# Altium schematic sheet Pinout_Toygether_Sch.SchDoc
size A4
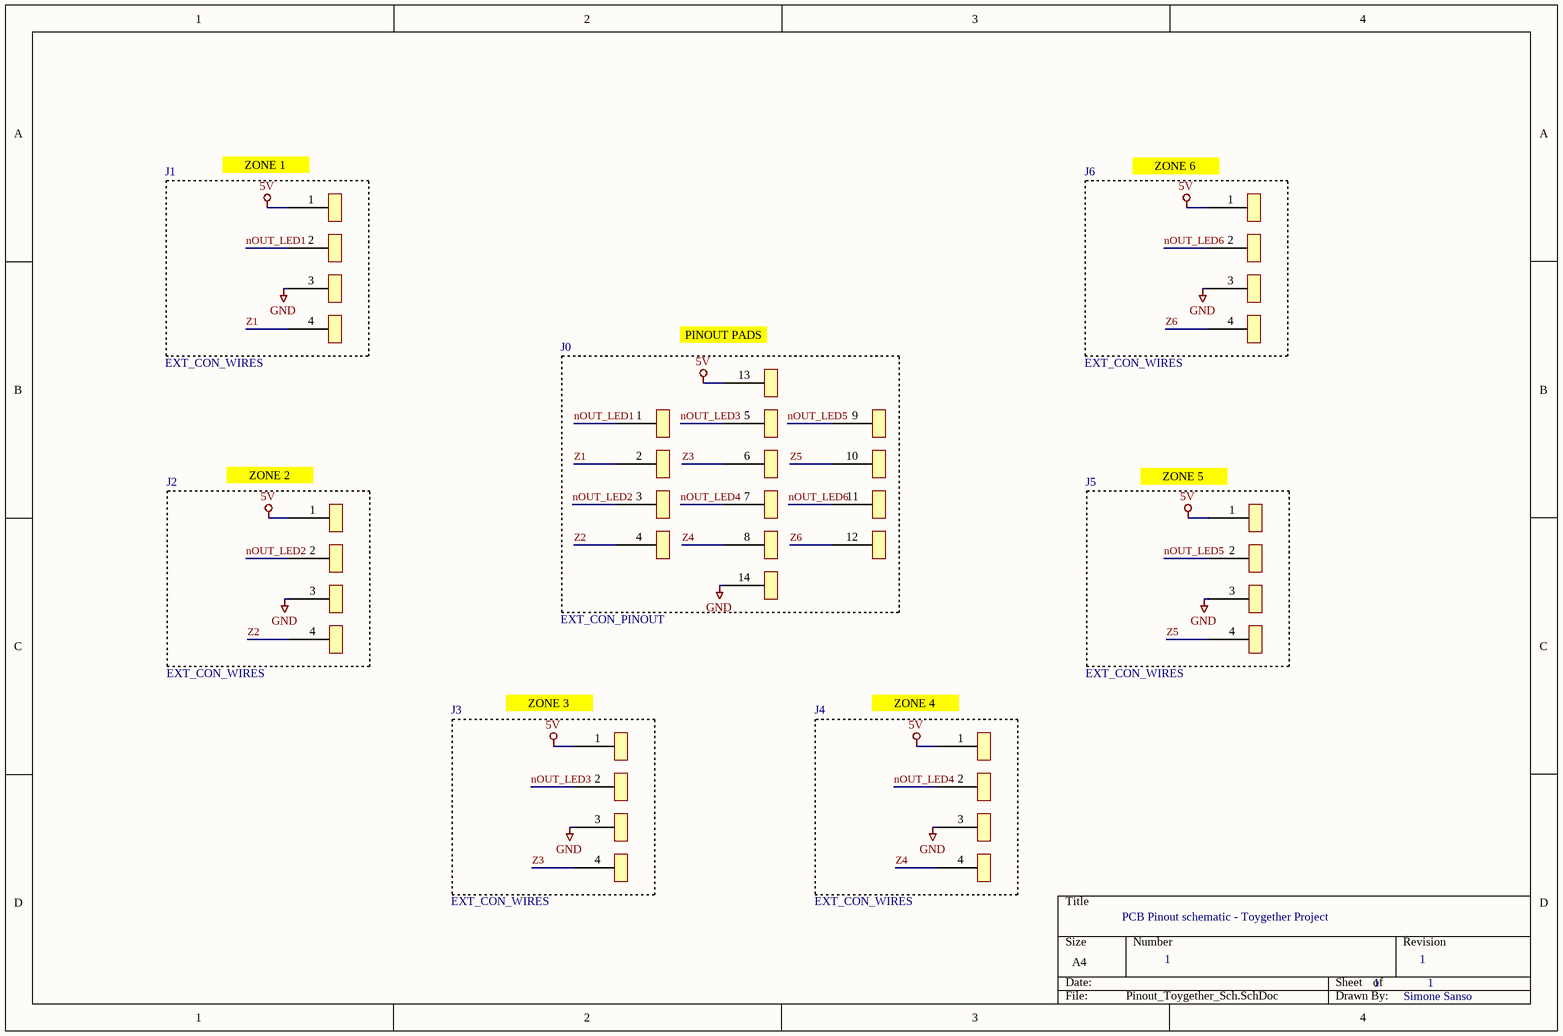
[diagram p0: Pinout_Toygether_Sch.SchDoc]

## Parts
J0  EXT_CON_PINOUT  [EXT_CON_PINOUT_14P]
J1  EXT_CON_WIRES  [EXT_CON_WIRES_4P]
J2  EXT_CON_WIRES  [EXT_CON_WIRES_4P]
J3  EXT_CON_WIRES  [EXT_CON_WIRES_4P]
J4  EXT_CON_WIRES  [EXT_CON_WIRES_4P]
J5  EXT_CON_WIRES  [EXT_CON_WIRES_4P]
J6  EXT_CON_WIRES  [EXT_CON_WIRES_4P]

## Nets
5V: J0.13 J1.1 J2.1 J3.1 J4.1 J5.1 J6.1
GND: J0.14 J1.3 J2.3 J3.3 J4.3 J5.3 J6.3
nOUT_LED1: J0.1 J1.2
nOUT_LED2: J0.3 J2.2
nOUT_LED3: J0.5 J3.2
nOUT_LED4: J0.7 J4.2
nOUT_LED5: J0.9 J5.2
nOUT_LED6: J0.11 J6.2
Z1: J0.2 J1.4
Z2: J0.4 J2.4
Z3: J0.6 J3.4
Z4: J0.8 J4.4
Z5: J0.10 J5.4
Z6: J0.12 J6.4

## Notes on the sheet
- (near J1) ZONE 1
- (near J6) ZONE 6
- (near J0) PINOUT PADS
- (near J2) ZONE 2
- (near J5) ZONE 5
- (near J3) ZONE 3
- (near J4) ZONE 4
- PCB Pinout schematic - Toygether Project
- 1
- Simone Sanso

## Library data of the parts
J0 = EXT_CON_PINOUT: Pinout for the LEDs and capacitive touch sensors (on the plush toy)
J1-J6 = EXT_CON_WIRES: Pads between pinout board and wires of the plush toy